# EAGLE design SF354 adapter pcb v1.5 (EAGLE 9.6.2)
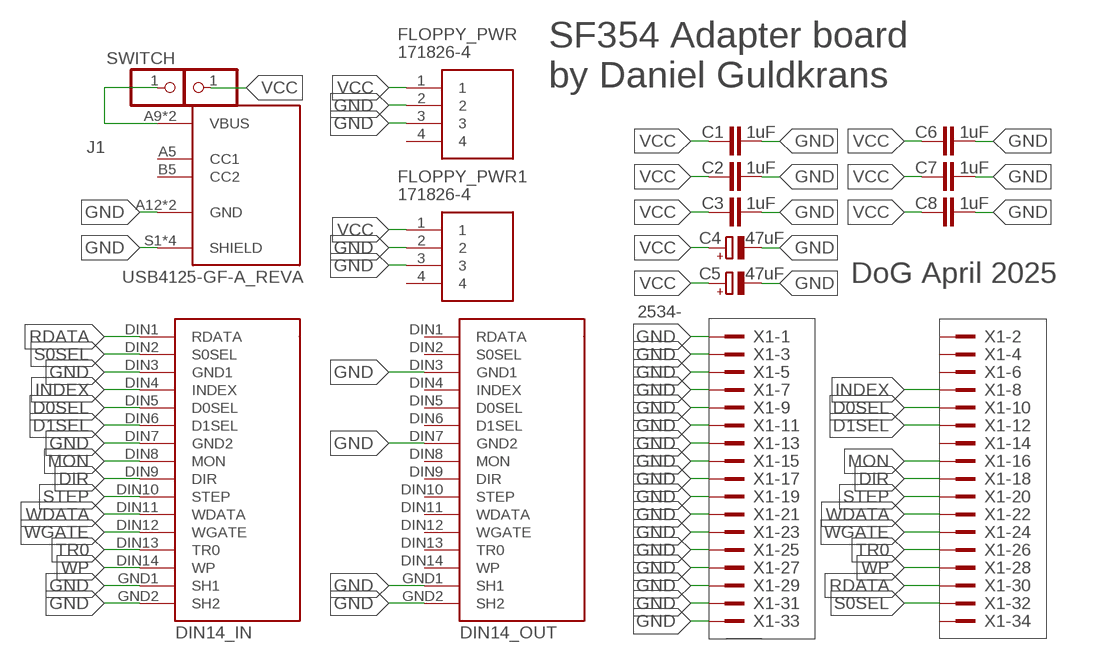
[diagram p0: schematic, sheet 1]

## Parts
C1  1uF  C-EUC1206  [C1206]
C2  1uF  C-EUC0805  [C0805]
C3  1uF  C-EU050-025X075  [C050-025X075]
C4  47uF  CPOL-EUUD-6,3X7,7  [UD-6,3X7,7_NICHICON]
C5  47uF  CPOL-EUE5-10.5  [E5-10,5]
C6  1uF  C-EUC1206  [C1206]
C7  1uF  C-EUC0805  [C0805]
C8  1uF  C-EU050-025X075  [C050-025X075]
FLOPPY_PWR  171826-4  [SHDRRA4W69P0X250_1X4_1000X1350]
FLOPPY_PWR1  171826-4  [SHDRRA4W69P0X250_1X4_1000X1350]
J1  USB4125-GF-A_REVA  [GCT_USB4125-GF-A_REVA]
JP1  PINHD-1X11X01_BH  [1X01_BH]
JP2  PINHD-1X11X01_BH  [1X01_BH]
U$1  DIN14  [DIN14]
U$2  DIN14  [DIN14]
X1  2534-  [PAK100/2500-34]

## Nets
D0SEL: U$1.DIN5(D0SEL) X1.10
D1SEL: U$1.DIN6(D1SEL) X1.12
DIR: U$1.DIN9(DIR) X1.18
GND: C1.2 C2.2 C3.2 C4.- C5.- C6.2 C7.2 C8.2 FLOPPY_PWR1.2 FLOPPY_PWR1.3 FLOPPY_PWR.2 FLOPPY_PWR.3 J1.A12(GND) J1.B12(GND) J1.S1(SHIELD) J1.S2(SHIELD) J1.S3(SHIELD) J1.S4(SHIELD) U$1.DIN3(GND1) U$1.DIN7(GND2) U$1.GND1(SH1) U$1.GND2(SH2) U$2.DIN3(GND1) U$2.DIN7(GND2) U$2.GND1(SH1) U$2.GND2(SH2) X1.1 X1.3 X1.5 X1.7 X1.9 X1.11 X1.13 X1.15 X1.17 X1.19 X1.21 X1.23 X1.25 X1.27 X1.29 X1.31 X1.33
INDEX: U$1.DIN4(INDEX) X1.8
MON: U$1.DIN8(MON) X1.16
N$1: J1.A9(VBUS) J1.B9(VBUS) JP2.1
RDATA: U$1.DIN1(RDATA) X1.30
S0SEL: U$1.DIN2(S0SEL) X1.32
STEP: U$1.DIN10(STEP) X1.20
TR0: U$1.DIN13(TR0) X1.26
VCC: C1.1 C2.1 C3.1 C4.+ C5.+ C6.1 C7.1 C8.1 FLOPPY_PWR1.1 FLOPPY_PWR.1 JP1.1
WDATA: U$1.DIN11(WDATA) X1.22
WGATE: U$1.DIN12(WGATE) X1.24
WP: U$1.DIN14(WP) X1.28
Unconnected: FLOPPY_PWR1.4 FLOPPY_PWR.4 J1.A5(CC1) J1.B5(CC2) U$2.DIN1(RDATA) U$2.DIN2(S0SEL) U$2.DIN4(INDEX) U$2.DIN5(D0SEL) U$2.DIN6(D1SEL) U$2.DIN8(MON) U$2.DIN9(DIR) U$2.DIN10(STEP) U$2.DIN11(WDATA) U$2.DIN12(WGATE) U$2.DIN13(TR0) U$2.DIN14(WP) X1.2 X1.4 X1.6 X1.14 X1.34

## Notes on the sheet
- SWITCH
- SF354 Adapter board
  by Daniel Guldkrans
- DoG April 2025
- DIN14_IN | DIN14_OUT

## Library data of the parts
C1-C3 C6-C8 = rcl:C-EU: CAPACITOR, European symbol; SPICEPREFIX: C
C4 C5 = rcl:CPOL-EU: POLARIZED CAPACITOR, European symbol; SPICEPREFIX: C
FLOPPY_PWR FLOPPY_PWR1 = SamacSys_Parts:171826-4: Headers & Wire Housings 4P HDR R/A Source: Datasheet <https://componentsearchengine.com/Datasheets/2/171826-4.pdf>; DESCRIPTION: Headers & Wire Housings 4P HDR R/A; HEIGHT: 6.7mm; MANUFACTURER_NAME: TE Connectivity; MANUFACTURER_PART_NUMBER: 171826-4; MOUSER_PART_NUMBER: 571-1718264; MOUSER_PRICE-STOCK: https://www.mouser.co.uk/ProductDetail/TE-Connectivity/171826-4?qs=4hg9R9g9MDt3qYFe2l2pbA%3D%3D
J1 = USB4125-GF-A_REVA:USB4125-GF-A_REVA: USB 2.0 Type C Receptacle, Horizontal, SMT, For Power charging Check prices <https://pricing.snapeda.com/parts/USB4125-GF-A/Global%20Connector%20Technology/view-part?ref=eda>; AVAILABILITY: Warning; DESCRIPTION: USB Charge Only Connector Type C Horizontal Receptacle, 3.16mm profile, 6 Pins, Surface mount, Top mount, low cost; MF: Global Connector Technology; MP: USB4125-GF-A; PACKAGE: None; PRICE: None; PURCHASE-URL: https://pricing.snapeda.com/search/part/USB4125-GF-A/?ref=eda
JP1 JP2 = pinhead:PINHD-1X1: PIN HEADER
U$1 U$2 = DIN14:DIN14
X1 = con-3m:2534-: 3M (TM) Pak 100 4-Wall Header Source: 3M; OC_FARNELL: unknown; OC_NEWARK: unknown

## Board
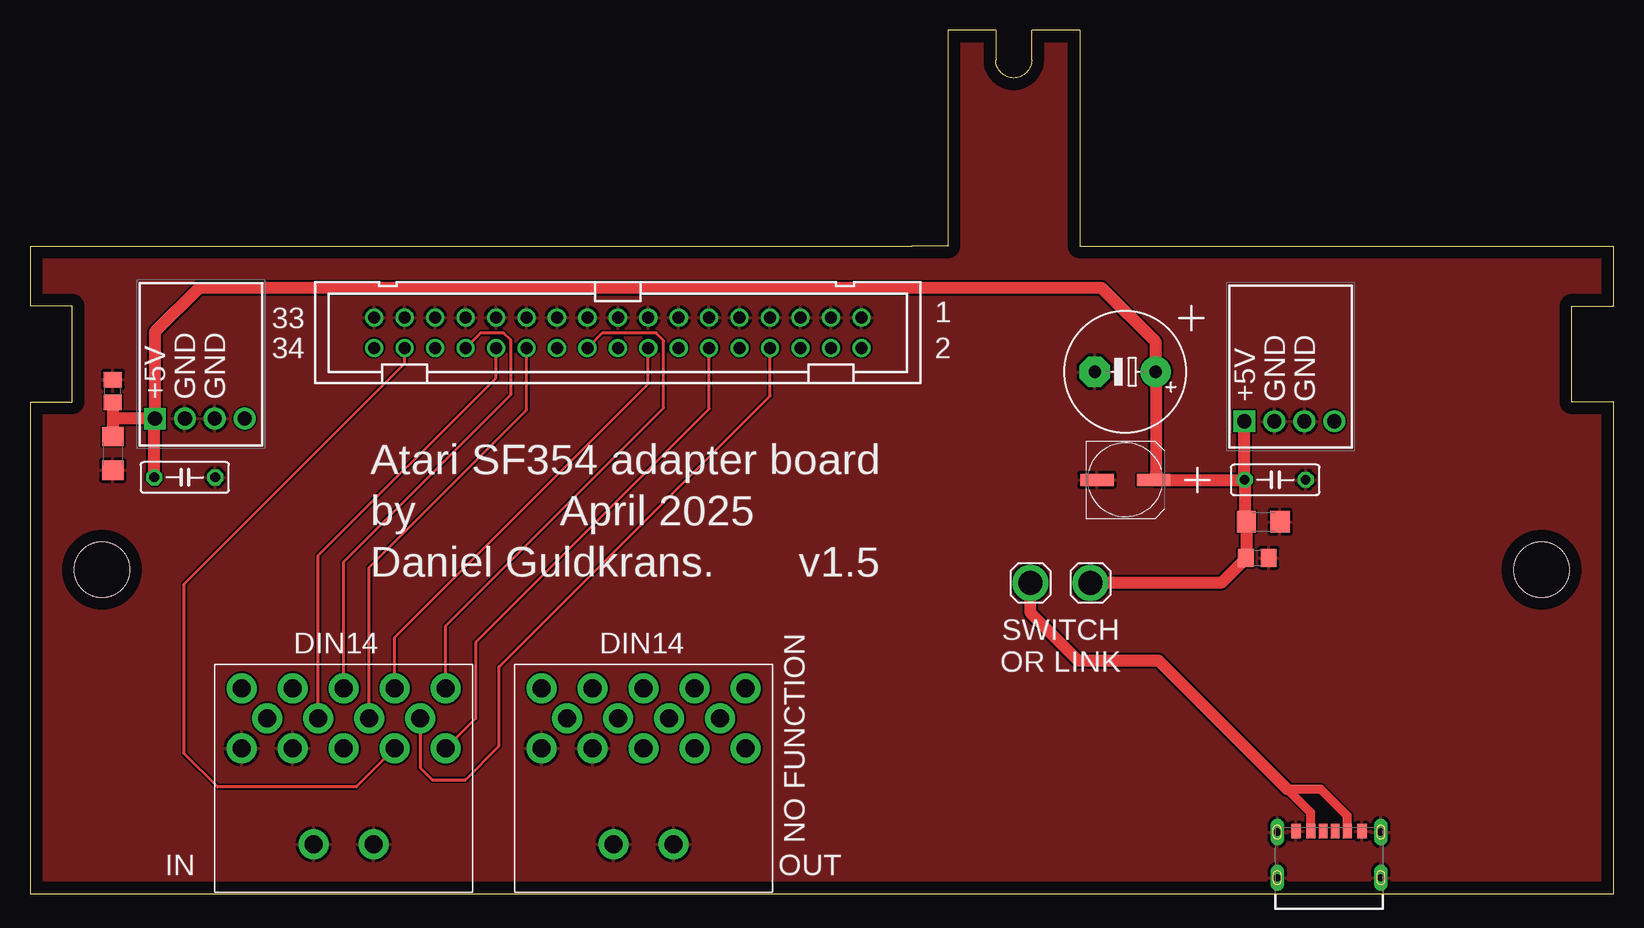
[diagram p1: board, top side]
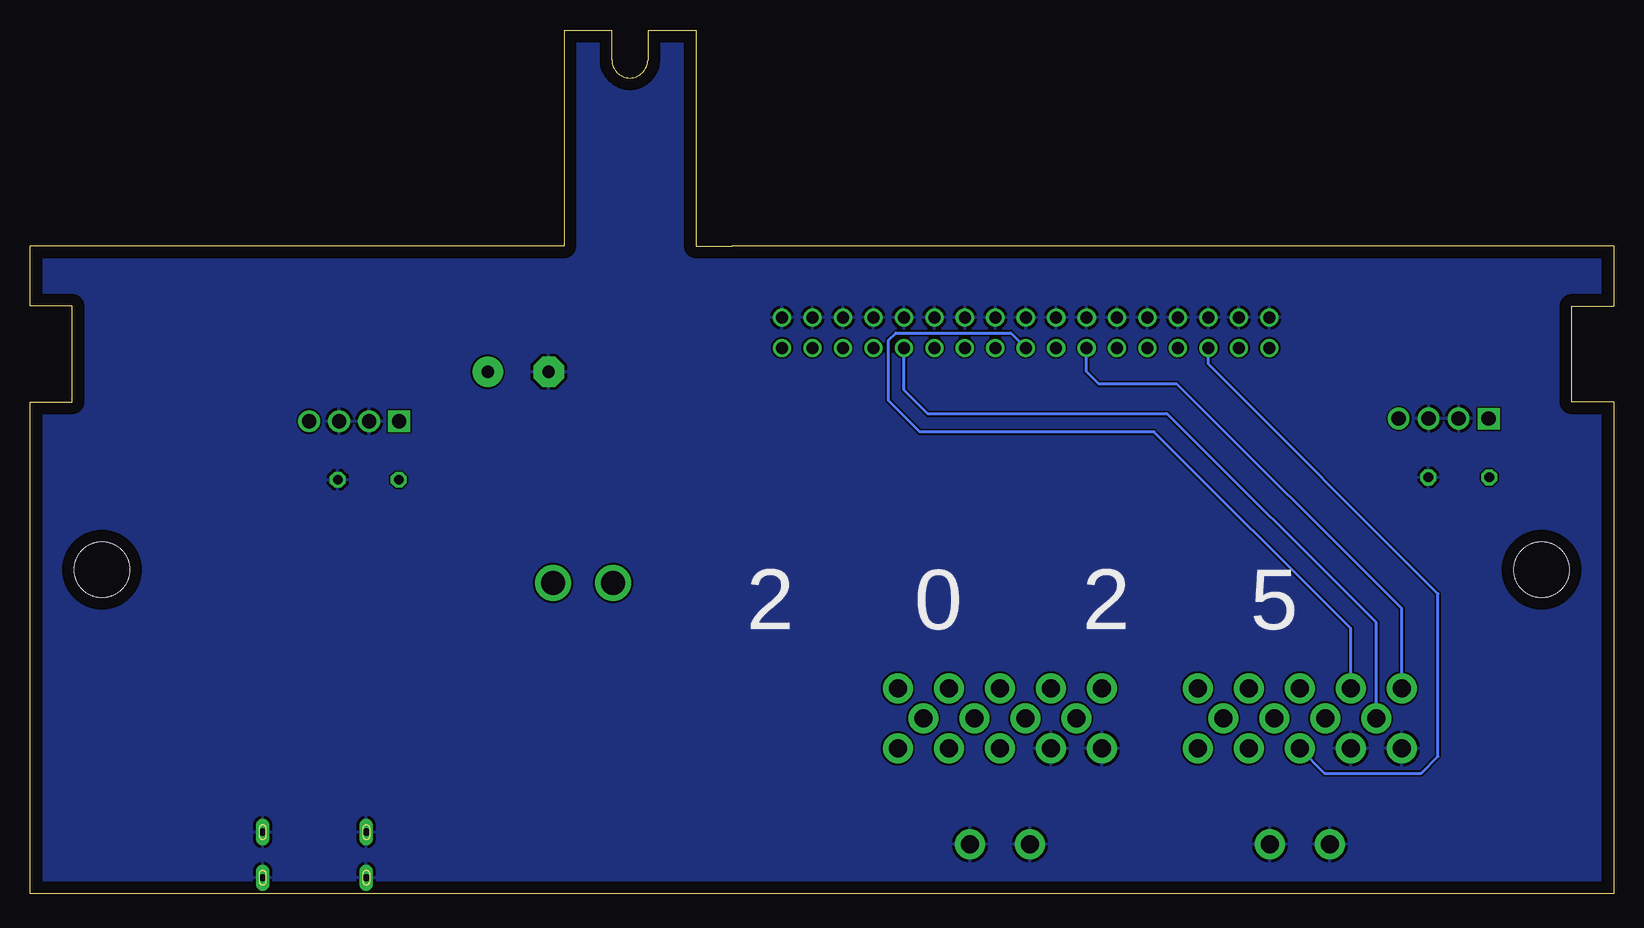
[diagram p2: board, bottom side, seen from below]

Size 132 x 72 mm. Coordinates in mm from the lower left corner, seen from the top.
Outline: 0,0 132,0 132,41 128.5,41 128.5,49 132,49 132,54 87.5,54 87.5,72 83.5,72 83.5,69.5 arc-180 80.5,69.5 80.5,72 76.5,72 76.5,54 73.5,54 0,54 0,49 3.5,49 3.5,41 0,41 0,0
Copper layers (1*16): Top 0.035mm / dielectric 1.5mm / Bottom 0.035mm
Design rules "default *": minimum track width 6mil, minimum drill 0.35mm, track to track 6mil, track to pad 6mil, pad to pad 6mil, via to via 6mil, smd to smd 6mil, copper to edge 40mil, drill to drill 6mil, minimum pad ring 10mil, minimum via ring 8mil, stop-mask expansion 4mil, vias tented up to drill 40mil, thermal gap 10mil
Holes 4.6 mm at 126,27 6,27

### Footprints (pad centres in the part's own frame; a part is rotated, then mirrored left to right if it is on the bottom)
C1206 = smd 1.6 x 1.8: 1 -1.4,0; 2 1.4,0
C0805 = smd 1.3 x 1.5: 1 -0.95,0; 2 0.95,0
C050-025X075 = drill 0.813 octagon: 1 -2.54,0; 2 2.54,0
UD-6,3X7,7_NICHICON = smd 2.8 x 1: + 2.35,0; - -2.35,0
E5-10,5 = drill 1.016 pad 2.54: + -2.54,0 | drill 1.016 pad 2.54 octagon: - 2.54,0
SHDRRA4W69P0X250_1X4_1000X1350 = drill 1.2 pad 1.8 square: 1 0,0 | drill 1.2 pad 1.8: 2 2.5,0; 3 5,0; 4 7.5,0
GCT_USB4125-GF-A_REVA = smd 0.7 x 1.2: A5 -0.5,0.08; B5 0.5,0.08 | smd 0.76 x 1.2: A9 1.52,0.08; B9 -1.52,0.08 | smd 0.8 x 1.2: A12 2.75,0.08; B12 -2.75,0.08 | drill 0.6 pad 1.1 long: S1 -4.32,0; S2 4.32,0; S3 -4.32,-3.8; S4 4.32,-3.8
1X01_BH = drill 2: 1 0,0
DIN14 = drill 1.5 pad 2.5: DIN1 0,0; DIN2 -4.25,0; DIN3 4.25,0; DIN4 -6.375,-2.5; DIN5 6.375,-2.5; DIN6 -8.5,0; DIN7 8.5,0; DIN8 -4.25,-5; DIN9 4.25,-5; DIN10 -8.5,-5; DIN11 8.5,-5; DIN12 -2.125,-2.5; DIN13 2.125,-2.5; DIN14 0,-5; GND1 -2.5,8; GND2 2.5,8
PAK100/2500-34 = drill 1 pad 1.422: 1 -20.32,-1.27; 2 -20.32,1.27; 3 -17.78,-1.27; 4 -17.78,1.27; 5 -15.24,-1.27; 6 -15.24,1.27; 7 -12.7,-1.27; 8 -12.7,1.27; 9 -10.16,-1.27; 10 -10.16,1.27; 11 -7.62,-1.27; 12 -7.62,1.27; 13 -5.08,-1.27; 14 -5.08,1.27; 15 -2.54,-1.27; 16 -2.54,1.27; 17 0,-1.27; 18 0,1.27; 19 2.54,-1.27; 20 2.54,1.27; 21 5.08,-1.27; 22 5.08,1.27; 23 7.62,-1.27; 24 7.62,1.27; 25 10.16,-1.27; 26 10.16,1.27; 27 12.7,-1.27; 28 12.7,1.27; 29 15.24,-1.27; 30 15.24,1.27; 31 17.78,-1.27; 32 17.78,1.27; 33 20.32,-1.27; 34 20.32,1.27

### Placement (x,y rotation side)
C1  102.8,31 0 top
C2  102.3,28 0 top
C3  103.8,34.5 0 top
C4  91.3,34.5 0 top
C5  91.3,43.5 180 top
C6  6.9,36.7 270 top
C7  6.9,41.9 90 top
C8  12.9,34.7 0 top
FLOPPY_PWR  101.23,39.37 0 top
FLOPPY_PWR1  10.4,39.6 0 top
J1  108.28,5.12 0 top
JP1  88.4,25.9 0 top
JP2  83.4,25.9 0 top
U$1  26.16,12.1 180 top
U$2  51.16,12.1 180 top
X1  49,46.76 180 top

### Tracks (layer width: path | path; a pad name or v marks a point on that pad's centre or on a via)
D0SEL
  Bottom 0.254: X1.10 59.16,42 57.16,40 37.2,40 19.79,22.59 U$1.DIN5
D1SEL
  Top 0.254: U$1.DIN6 37.16,14.6 37.16,20.94 56.62,40.4 X1.12
DIR
  Bottom 0.254: X1.18 50.25,46.74 59.83,46.74 60.42,46.14 60.42,41.1 57.82,38.5 38.3,38.5 21.91,22.11 U$1.DIN9
GND
  pour Top: 0,54 76.5,54 76.5,72 87.5,72 87.5,54 132,54 132,0 0,0
  pour Bottom: 0,0 0,54 76.5,54 76.5,72 87.5,72 87.5,54 132,54 132,0
INDEX
  Top 0.254: X1.8 61.7,41.5 39.1,18.9 39.1,12.3 36.3,9.5 33.5,9.5 32.53,10.46 U$1.DIN4
MON
  Top 0.254: X1.16 51.54,42.5 30.41,21.37 U$1.DIN8
N$1
  Top 0.305: 105,8.5 104.8,8.7
  Top 0.61: 104.8,8.7 105,8.5 106.76,6.74
  Top 0.75: J1.B9 106.76,6.74 104.8,8.7 107.6,8.7 109.8,6.5 J1.A9
  Top 1.016: JP2.1 83.4,23.4 87.4,19.4 94.1,19.4 103.7,9.8 104.8,8.7
RDATA
  Bottom 0.254: X1.30 33.76,44.13 14.63,25 14.63,11.43 16.03,10.03 24.09,10.03 U$1.DIN1
S0SEL
  Top 0.254: U$1.DIN2 27.2,8.89 15.63,8.89 12.86,11.66 12.86,25.81 31.22,44.17 X1.32
STEP
  Top 0.254: X1.20 47.71,46.74 52.19,46.74 52.83,46.1 52.83,40.5 34.66,22.33 U$1.DIN10
TR0
  Top 0.254: X1.26 38.84,43 24.04,28.2 U$1.DIN13
VCC
  Top 1.016: C3.1 101.26,31.14 C1.1 101.4,28.05 C2.1 101.35,27.95 99.3,25.9 JP1.1 | C3.1 C4.+ 93.84,34.69 C5.+ 93.84,45.96 89.3,50.5 14.1,50.5 10.4,46.8 FLOPPY_PWR1.1 | C3.1 101.23,34.53 FLOPPY_PWR.1 | C7.1 6.9,39.6 | 6.9,39.6 C6.1 | FLOPPY_PWR1.1 6.9,39.6 | C8.1 10.36,39.56 FLOPPY_PWR1.1
WDATA
  Bottom 0.254: X1.22 43.92,43.52 42.9,42.5 36.4,42.5 17.66,23.76 U$1.DIN11
WGATE
  Top 0.254: X1.24 41.38,40.3 28.29,27.2 U$1.DIN12
WP
  Top 0.254: X1.28 37.55,46.74 39.49,46.74 40.1,46.13 40.1,41.6 26.16,27.66 U$1.DIN14

### Text on the board
tPlace: Atari SF354 adapter board | by April 2025 | Daniel Guldkrans. v1.5 | DIN14 | DIN14 | IN | OUT
tNames: 33 | 1 | 34 | 2 | +5V | GND | GND | +5V | GND | GND | SWITCH / OR LINK | NO FUNCTION
bNames: 2 0 2 5